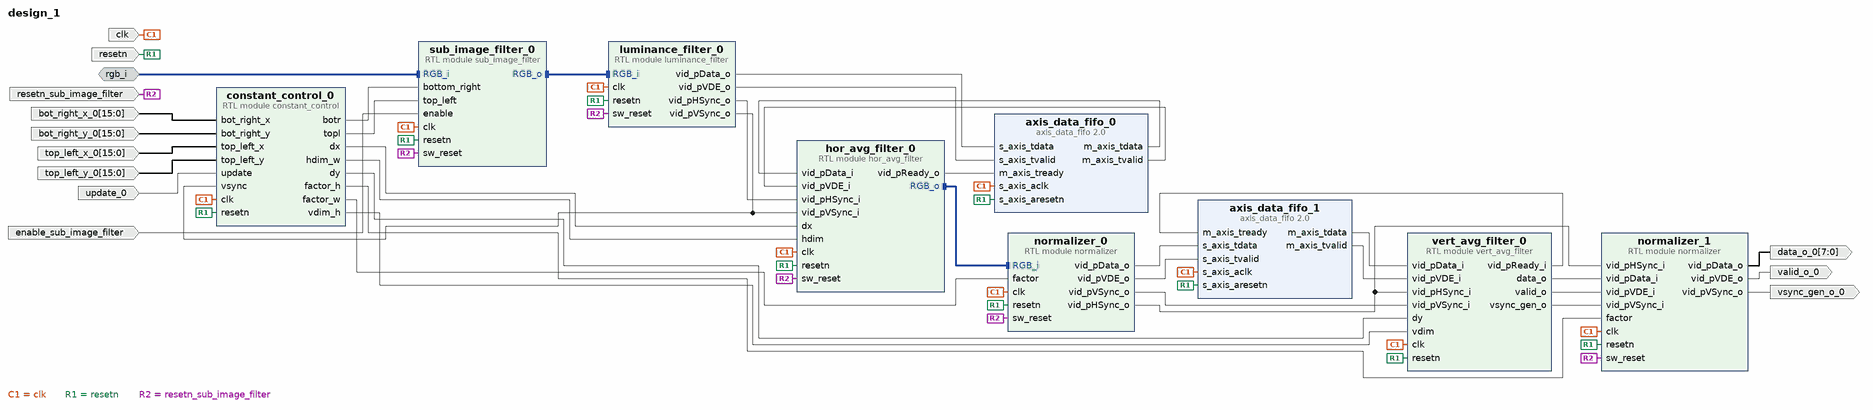
[diagram p0: block diagram of the top level]
# Vivado block design design_1, xc7a200tsbg484-1, Vivado 2023.2
create_bd_design design_1

create_bd_intf_port -mode Slave -vlnv xilinx.com:interface:vid_io_rtl:1.0 rgb_i
create_bd_port -dir I clk
create_bd_port -dir I resetn
create_bd_port -dir I -type rst resetn_sub_image_filter
create_bd_port -dir I enable_sub_image_filter
create_bd_port -dir O valid_o_0
create_bd_port -dir O -from 7 -to 0 data_o_0
create_bd_port -dir O vsync_gen_o_0
create_bd_port -dir I update_0
create_bd_port -dir I -from 15 -to 0 bot_right_y_0
create_bd_port -dir I -from 15 -to 0 bot_right_x_0
create_bd_port -dir I -from 15 -to 0 top_left_y_0
create_bd_port -dir I -from 15 -to 0 top_left_x_0

create_bd_cell -type module -reference sub_image_filter sub_image_filter_0
create_bd_cell -type module -reference luminance_filter luminance_filter_0
create_bd_cell -type module -reference hor_avg_filter hor_avg_filter_0
create_bd_cell -type ip -vlnv xilinx.com:ip:axis_data_fifo:2.0 axis_data_fifo_0
set_property -dict {CONFIG.FIFO_DEPTH 64 CONFIG.HAS_RD_DATA_COUNT 1 CONFIG.HAS_WR_DATA_COUNT 1} [get_bd_cells axis_data_fifo_0]
create_bd_cell -type module -reference vert_avg_filter vert_avg_filter_0
create_bd_cell -type ip -vlnv xilinx.com:ip:axis_data_fifo:2.0 axis_data_fifo_1
set_property -dict {CONFIG.FIFO_DEPTH 32 CONFIG.HAS_RD_DATA_COUNT 1 CONFIG.HAS_WR_DATA_COUNT 1} [get_bd_cells axis_data_fifo_1]
create_bd_cell -type module -reference normalizer normalizer_0
create_bd_cell -type module -reference normalizer normalizer_1
create_bd_cell -type module -reference constant_control constant_control_0

# ---- connections ----

connect_bd_intf_net [get_bd_intf_pins normalizer_0/RGB_i] [get_bd_intf_pins hor_avg_filter_0/RGB_o]
connect_bd_intf_net [get_bd_intf_ports rgb_i] [get_bd_intf_pins sub_image_filter_0/RGB_i]
connect_bd_intf_net [get_bd_intf_pins sub_image_filter_0/RGB_o] [get_bd_intf_pins luminance_filter_0/RGB_i]
connect_bd_net [get_bd_pins axis_data_fifo_0/m_axis_tdata] [get_bd_pins hor_avg_filter_0/vid_pData_i]
connect_bd_net [get_bd_pins axis_data_fifo_0/m_axis_tvalid] [get_bd_pins hor_avg_filter_0/vid_pVDE_i]
connect_bd_net [get_bd_pins axis_data_fifo_1/m_axis_tdata] [get_bd_pins vert_avg_filter_0/vid_pData_i]
connect_bd_net [get_bd_pins axis_data_fifo_1/m_axis_tvalid] [get_bd_pins vert_avg_filter_0/vid_pVDE_i]
connect_bd_net -net bot_right_x_0_1 [get_bd_ports bot_right_x_0] [get_bd_pins constant_control_0/bot_right_x]
connect_bd_net -net bot_right_y_0_1 [get_bd_ports bot_right_y_0] [get_bd_pins constant_control_0/bot_right_y]
connect_bd_net [get_bd_ports clk] \
  [get_bd_pins axis_data_fifo_0/s_axis_aclk] [get_bd_pins luminance_filter_0/clk] [get_bd_pins hor_avg_filter_0/clk] \
  [get_bd_pins axis_data_fifo_1/s_axis_aclk] [get_bd_pins vert_avg_filter_0/clk] [get_bd_pins normalizer_0/clk] \
  [get_bd_pins normalizer_1/clk] [get_bd_pins constant_control_0/clk] [get_bd_pins sub_image_filter_0/clk]
connect_bd_net [get_bd_pins constant_control_0/botr] [get_bd_pins sub_image_filter_0/bottom_right]
connect_bd_net [get_bd_pins constant_control_0/dx] [get_bd_pins hor_avg_filter_0/dx]
connect_bd_net [get_bd_pins constant_control_0/dy] [get_bd_pins vert_avg_filter_0/dy]
connect_bd_net [get_bd_pins constant_control_0/factor_h] [get_bd_pins normalizer_1/factor]
connect_bd_net [get_bd_pins constant_control_0/factor_w] [get_bd_pins normalizer_0/factor]
connect_bd_net [get_bd_pins constant_control_0/hdim_w] [get_bd_pins hor_avg_filter_0/hdim]
connect_bd_net [get_bd_pins constant_control_0/topl] [get_bd_pins sub_image_filter_0/top_left]
connect_bd_net [get_bd_pins constant_control_0/vdim_h] [get_bd_pins vert_avg_filter_0/vdim]
connect_bd_net [get_bd_ports enable_sub_image_filter] [get_bd_pins sub_image_filter_0/enable]
connect_bd_net -net hor_avg_filter_0_vid_pReady_i [get_bd_pins hor_avg_filter_0/vid_pReady_o] [get_bd_pins axis_data_fifo_0/m_axis_tready]
connect_bd_net [get_bd_pins luminance_filter_0/vid_pData_o] [get_bd_pins axis_data_fifo_0/s_axis_tdata]
connect_bd_net [get_bd_pins luminance_filter_0/vid_pHSync_o] [get_bd_pins hor_avg_filter_0/vid_pHSync_i]
connect_bd_net [get_bd_pins luminance_filter_0/vid_pVDE_o] [get_bd_pins axis_data_fifo_0/s_axis_tvalid]
connect_bd_net [get_bd_pins luminance_filter_0/vid_pVSync_o] [get_bd_pins hor_avg_filter_0/vid_pVSync_i] [get_bd_pins constant_control_0/vsync]
connect_bd_net [get_bd_pins normalizer_0/vid_pData_o] [get_bd_pins axis_data_fifo_1/s_axis_tdata]
connect_bd_net [get_bd_pins normalizer_0/vid_pHSync_o] [get_bd_pins vert_avg_filter_0/vid_pHSync_i] [get_bd_pins normalizer_1/vid_pHSync_i]
connect_bd_net [get_bd_pins normalizer_0/vid_pVDE_o] [get_bd_pins axis_data_fifo_1/s_axis_tvalid]
connect_bd_net [get_bd_pins normalizer_0/vid_pVSync_o] [get_bd_pins vert_avg_filter_0/vid_pVSync_i]
connect_bd_net [get_bd_pins normalizer_1/vid_pData_o] [get_bd_ports data_o_0]
connect_bd_net [get_bd_pins normalizer_1/vid_pVDE_o] [get_bd_ports valid_o_0]
connect_bd_net [get_bd_pins normalizer_1/vid_pVSync_o] [get_bd_ports vsync_gen_o_0]
connect_bd_net [get_bd_ports resetn] \
  [get_bd_pins luminance_filter_0/resetn] [get_bd_pins axis_data_fifo_0/s_axis_aresetn] [get_bd_pins hor_avg_filter_0/resetn] \
  [get_bd_pins axis_data_fifo_1/s_axis_aresetn] [get_bd_pins vert_avg_filter_0/resetn] [get_bd_pins normalizer_0/resetn] \
  [get_bd_pins normalizer_1/resetn] [get_bd_pins constant_control_0/resetn] [get_bd_pins sub_image_filter_0/resetn]
connect_bd_net -net sw_reset_0_1 [get_bd_ports resetn_sub_image_filter] \
  [get_bd_pins luminance_filter_0/sw_reset] [get_bd_pins hor_avg_filter_0/sw_reset] [get_bd_pins normalizer_0/sw_reset] \
  [get_bd_pins normalizer_1/sw_reset] [get_bd_pins sub_image_filter_0/sw_reset]
connect_bd_net -net top_left_x_0_1 [get_bd_ports top_left_x_0] [get_bd_pins constant_control_0/top_left_x]
connect_bd_net -net top_left_y_0_1 [get_bd_ports top_left_y_0] [get_bd_pins constant_control_0/top_left_y]
connect_bd_net -net update_0_1 [get_bd_ports update_0] [get_bd_pins constant_control_0/update]
connect_bd_net [get_bd_pins vert_avg_filter_0/data_o] [get_bd_pins normalizer_1/vid_pData_i]
connect_bd_net [get_bd_pins vert_avg_filter_0/valid_o] [get_bd_pins normalizer_1/vid_pVDE_i]
connect_bd_net [get_bd_pins vert_avg_filter_0/vid_pReady_i] [get_bd_pins axis_data_fifo_1/m_axis_tready]
connect_bd_net [get_bd_pins vert_avg_filter_0/vsync_gen_o] [get_bd_pins normalizer_1/vid_pVSync_i]

validate_bd_design
save_bd_design
